# EAGLE design Comm_board_2024_L76 (EAGLE 9.6.2)
CHECKED: 02/25/2025; COMPANY: CDOSR; DATE: 02/25/2024; DESIGNER: CDOSR; DRAWN: 02/25/2024; DRGNO: 1; REV: 01; VERSION: v10; YEAR: 2024
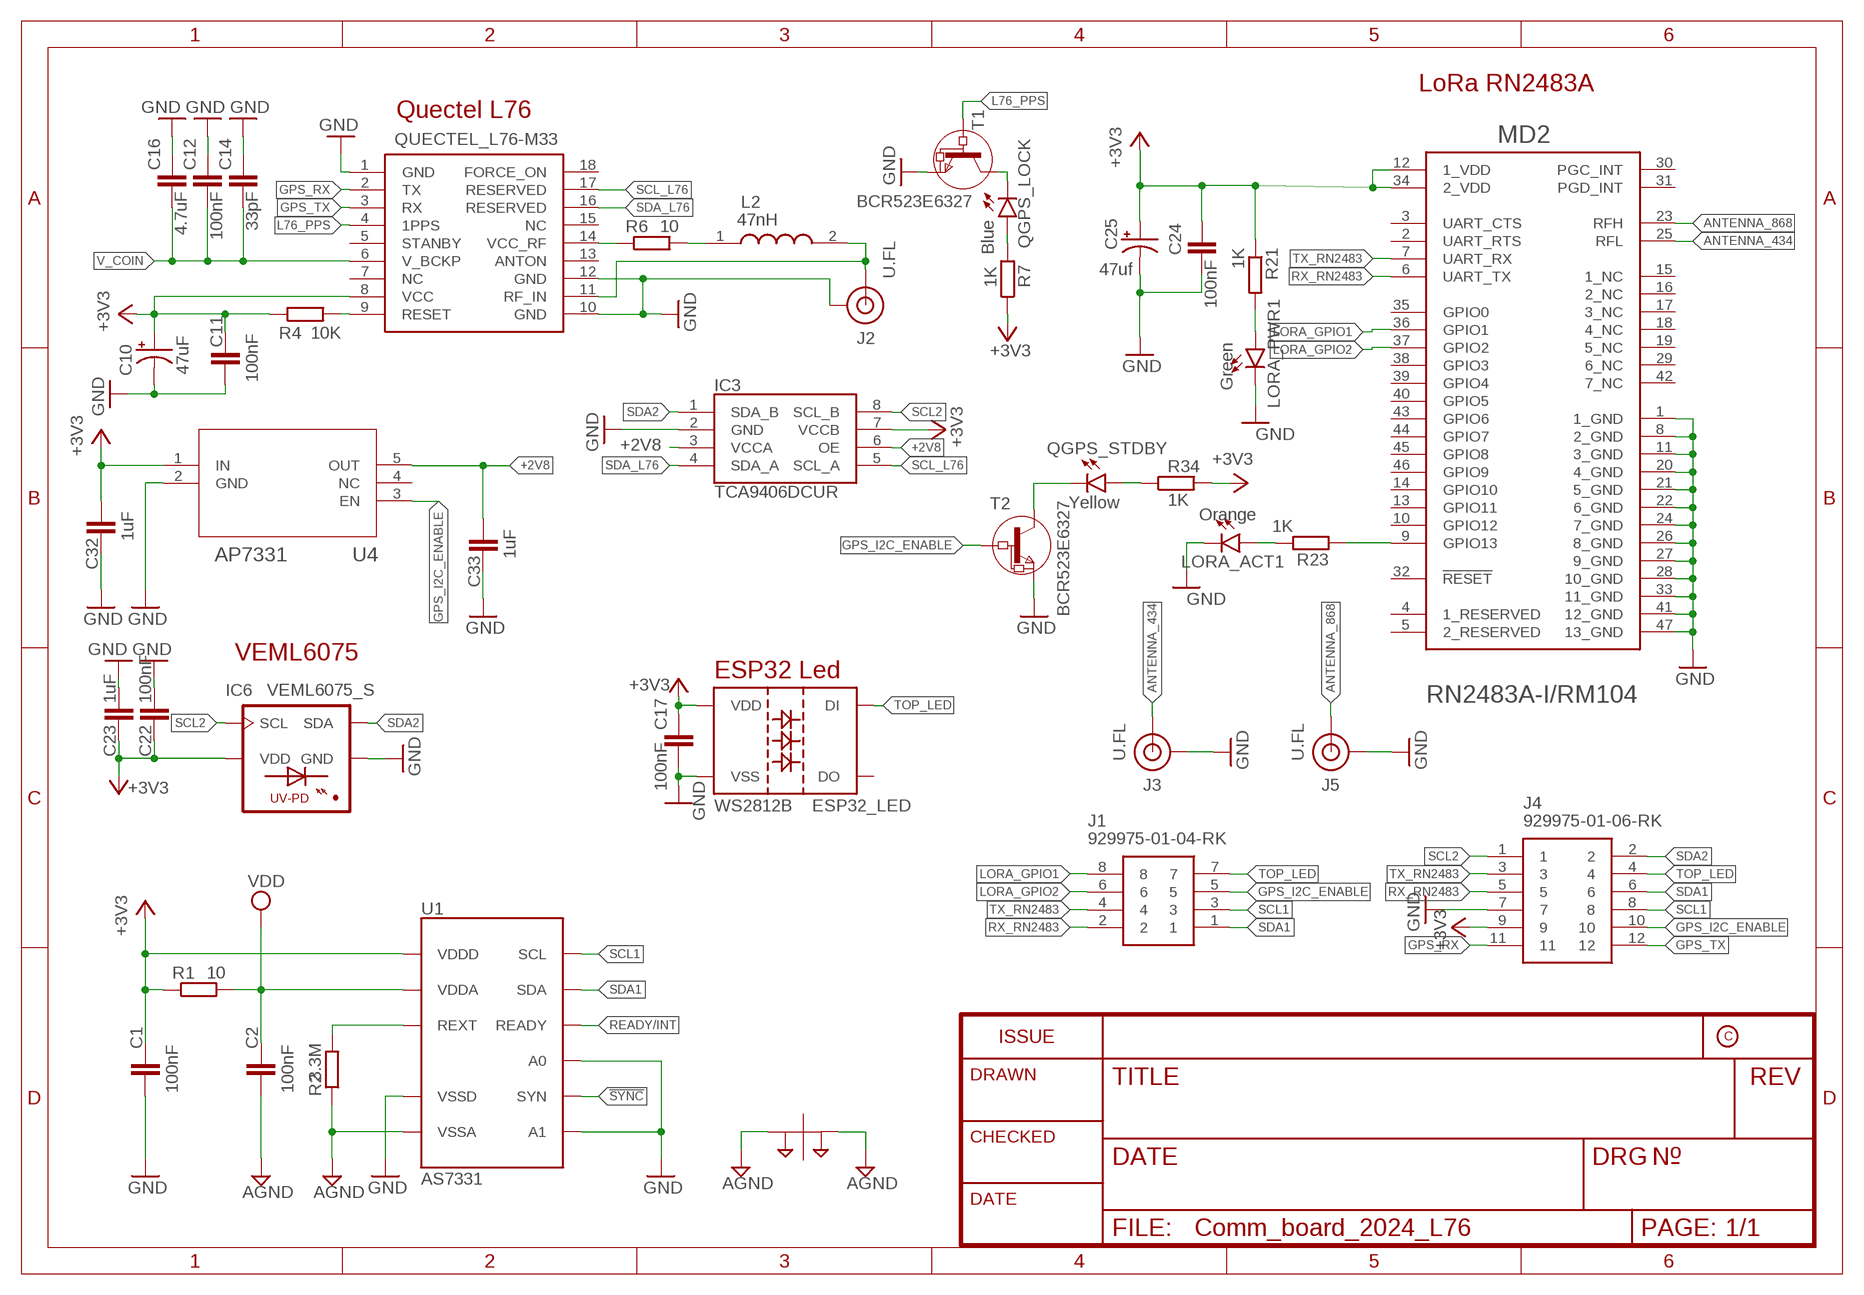
[diagram p0: schematic, sheet 1]

## Parts
C1  100nF  C-EUC0603  [C0603]
C2  100nF  C-EUC0603  [C0603]
C10  47uF  293D226X9025C2TE3  [CAPMP6032X250N]
C11  100nF  C-EUC0603  [C0603]
C12  100nF  C-EUC0603  [C0603]
C14  33pF  C-EUC0603  [C0603]
C16  4.7uF  C-EUC0603  [C0603]
C17  100nF  C-EUC0603  [C0603]
C22  100nF  C-EUC0603  [C0603]
C23  1uF  C-EUC0603  [C0603]
C24  100nF  C-EUC0603  [C0603]
C25  47uf  293D226X9025C2TE3  [CAPMP6032X250N]
C32  1uF  C-EUC0603  [C0603]
C33  1uF  C-EUC0603  [C0603]
ESP32_LED  WS2812B  [WS2812B]
IC3  TCA9406DCUR  [SOP50P310X90-8N]
IC6  VEML6075_S  [VISHAY_VEML6075_1.25X2X1]
J1  929975-01-04-RK  [RHDR8W76P254_2X4_1016X508X839P]
J2  U.FL  SPARKFUN-CONNECTORS_SPARKFUN-CONNECTORS_U.FL2PIN  [SPARKFUN-CONNECTORS_SPARKFUN-CONNECTORS_U.FL]
J3  U.FL  SPARKFUN-CONNECTORS_SPARKFUN-CONNECTORS_U.FL2PIN  [SPARKFUN-CONNECTORS_SPARKFUN-CONNECTORS_U.FL]
J4  929975-01-06-RK  [RHDR12W76P254_2X6_1524X508X839]
J5  U.FL  SPARKFUN-CONNECTORS_SPARKFUN-CONNECTORS_U.FL2PIN  [SPARKFUN-CONNECTORS_SPARKFUN-CONNECTORS_U.FL]
L2  47nH  LQW2UAS47NF00L  [LQW2UAS12NG00L]
LORA_ACT1  Orange  LEDCHIP-LED0603  [CHIP-LED0603]
LORA_PWR1  Green  LEDCHIP-LED0603  [CHIP-LED0603]
MD2  RM104_MICROCHIP_RN2483A-I-RM104MICROCHIP_RN2483A-I-RM104_0_0  [RM104_MICROCHIP_RN2483A-I-RM104_0]
QGPS_LOCK  Blue  LEDCHIP-LED0603  [CHIP-LED0603]
QGPS_STDBY  Yellow  LEDCHIP-LED0603  [CHIP-LED0603]
QUECTEL_L76-M33  L76 - M33  L76-M33  [L76-M33]
R1  10  R-EU_R0603  [R0603]
R2  3.3M  R-EU_R0603  [R0603]
R4  10K  R-EU_R0603  [R0603]
R6  10  R-EU_R0603  [R0603]
R7  1K  R-EU_R0603  [R0603]
R21  1K  R-EU_R0603  [R0603]
R23  1K  R-EU_R0603  [R0603]
R34  1K  R-EU_R0603  [R0603]
SUPPLYTIE1  SPARKFUN-POWERSYMBOLS_2PT_GND_TIE  [SPARKFUN-POWERSYMBOLS_2PT_GND_TIE]
T1  BCR523E6327  NPNSOT23  [SOT-23]
T2  BCR523E6327  NPNSOT23  [SOT-23]
U1  AS7331  SPARKFUN_QWIIC_UV_SENSOR_AS7331_UV_SENSOR_AS7331  [SPARKFUN_QWIIC_UV_SENSOR_AS7331_OLGA16]
U4  AP7331  AP7331-28WG-7SOT25_DIO  [SOT25_DIO]

## Nets
!SYNC: U1.8(SYN)
+2V8: C33.2 IC3.3(VCCA) IC3.6(OE) U4.5(OUT)
+3V3: C1.2 C10.1(+) C11.2 C17.1 C22.2 C23.1 C24.1 C25.1(+) C32.2 ESP32_LED.1(VDD) IC3.7(VCCB) IC6.4(VDD) J4.9 MD2.12(1_VDD) MD2.34(2_VDD) QUECTEL_L76-M33.8(VCC) R1.1 R4.1 R7.1 R21.1 R34.2 U1.10(VDDD) U4.1(IN)
AGND: C2.1 R2.1 SUPPLYTIE1.P$1 SUPPLYTIE1.P$2 U1.1(VSSA) U1.2(VSSA) U1.5(VSSA) U1.6(VSSA) U1.15(VSSA) U1.16(VSSA)
ANT1: J2.FEED(SIGNAL) L2.2 QUECTEL_L76-M33.11(RF_IN)
ANTENNA_434: J3.FEED(SIGNAL) MD2.25(RFL)
ANTENNA_868: J5.FEED(SIGNAL) MD2.23(RFH)
GND: C1.1 C10.2(-) C11.1 C12.2 C14.2 C16.2 C17.2 C22.1 C23.2 C24.2 C25.2(-) C32.1 C33.1 ESP32_LED.3(VSS) IC3.2(GND) IC6.1(GND) J2.1(GND) J2.2(GND) J2.3(GND) J3.1(GND) J3.2(GND) J3.3(GND) J4.7 J5.1(GND) J5.2(GND) J5.3(GND) LORA_ACT1.C LORA_PWR1.C MD2.1(1_GND) MD2.8(2_GND) MD2.11(3_GND) MD2.20(4_GND) MD2.21(5_GND) MD2.22(6_GND) MD2.24(7_GND) MD2.26(8_GND) MD2.27(9_GND) MD2.28(10_GND) MD2.33(11_GND) MD2.41(12_GND) MD2.47(13_GND) QUECTEL_L76-M33.1(GND) QUECTEL_L76-M33.10(GND) QUECTEL_L76-M33.12(GND) T1.2(E) T2.2(E) U1.7(A1) U1.11(VSSD) U1.14(A0) U4.2(GND)
GPS2_RESET: QUECTEL_L76-M33.9(RESET) R4.2
GPS_I2C_ENABLE: J1.5 J4.10 T2.3(B) U4.3(EN)
GPS_RX: J4.11 QUECTEL_L76-M33.2(TX)
GPS_TX: J4.12 QUECTEL_L76-M33.3(RX)
L76_PPS: QUECTEL_L76-M33.4(1PPS) T1.3(B)
LORA_GPIO1: J1.8 MD2.36(GPIO1)
LORA_GPIO2: J1.6 MD2.37(GPIO2)
N$1: QGPS_LOCK.C T1.1(C)
N$2: R2.2 U1.4(REXT)
N$8: QGPS_STDBY.C T2.1(C)
N$10: L2.1 R6.2
N$20: QGPS_STDBY.A R34.1
N$24: QUECTEL_L76-M33.14(VCC_RF) R6.1
N$37: QGPS_LOCK.A R7.2
N$41: MD2.9(GPIO13) R23.1
N$42: LORA_ACT1.A R23.2
N$43: LORA_PWR1.A R21.2
READY/INT: U1.9(READY)
RX_RN2483: J1.2 J4.5 MD2.6(UART_TX)
SCL1: J1.3 J4.8 U1.13(SCL)
SCL2: IC3.8(SCL_B) IC6.3(SCL) J4.1
SCL_L76: IC3.5(SCL_A) QUECTEL_L76-M33.17(RESERVED)
SDA1: J1.1 J4.6 U1.12(SDA)
SDA2: IC3.1(SDA_B) IC6.2(SDA) J4.2
SDA_L76: IC3.4(SDA_A) QUECTEL_L76-M33.16(RESERVED)
TOP_LED: ESP32_LED.4(DI) J1.7 J4.4
TX_RN2483: J1.4 J4.3 MD2.7(UART_RX)
V_COIN: C12.1 C14.1 C16.1 QUECTEL_L76-M33.6(V_BCKP)
VDD: C2.2 R1.2 U1.3(VDDA)
Unconnected: ESP32_LED.2(DO) MD2.2(UART_RTS) MD2.3(UART_CTS) MD2.4(1_RESERVED) MD2.5(2_RESERVED) MD2.10(GPIO12) MD2.13(GPIO11) MD2.14(GPIO10) MD2.15(1_NC) MD2.16(2_NC) MD2.17(3_NC) MD2.18(4_NC) MD2.19(5_NC) MD2.29(6_NC) MD2.30(PGC_INT) MD2.31(PGD_INT) MD2.32(!RESET!) MD2.35(GPIO0) MD2.38(GPIO3) MD2.39(GPIO4) MD2.40(GPIO5) MD2.42(7_NC) MD2.43(GPIO6) MD2.44(GPIO7) MD2.45(GPIO8) MD2.46(GPIO9) QUECTEL_L76-M33.5(STANBY) QUECTEL_L76-M33.7(NC) QUECTEL_L76-M33.13(ANTON) QUECTEL_L76-M33.15(NC) QUECTEL_L76-M33.18(FORCE_ON) U4.4(NC)

## Notes on the sheet
- LoRa RN2483A
- Quectel L76
- VEML6075
- ESP32 Led

## Library data of the parts
C1 C2 C11 C12 C14 C16 C17 C22-C24 C32 C33 = rcl:C-EU: CAPACITOR, European symbol; SPICEPREFIX: C
C10 C25 = 293D226X9025C2TE3:293D226X9025C2TE3: Surface Mount Tantalum Capacitor, TANTAMOUNTr, 293D Series, 22 F, 10%, 25 V, 2412 Check prices <https://pricing.snapeda.com/parts/293D226X9025C2TE3/Vishay/view-part?ref=eda>; AVAILABILITY: Warning; DESCRIPTION: Surface Mount Tantalum Capacitor, TANTAMOUNTr, 293D Series, 22 F, 10%, 25 V, 2412 [6032 Metric]; MF: Vishay; MP: 293D226X9025C2TE3; PACKAGE: None; PRICE: None; PURCHASE-URL: https://pricing.snapeda.com/search/part/293D226X9025C2TE3/?ref=eda
ESP32_LED = WS2812:WS2812B
IC3 = TCA9406DCUR:TCA9406DCUR: 2-Bit Bidirectional 1-MHz I2C Bus and SMBus Voltage-Level Shifter Source: Datasheet <http://www.ti.com/lit/ds/symlink/tca9406.pdf>; DESCRIPTION: 2-Bit Bidirectional 1-MHz I2C Bus and SMBus Voltage-Level Shifter; HEIGHT: 0.9mm; MANUFACTURER_NAME: Texas Instruments; MANUFACTURER_PART_NUMBER: TCA9406DCUR; MOUSER_PART_NUMBER: 595-TCA9406DCUR; MOUSER_PRICE-STOCK: https://www.mouser.co.uk/ProductDetail/Texas-Instruments/TCA9406DCUR?qs=Ze4%2FuFuz19JoG7CJtrwdKQ%3D%3D
IC6 = VEML6075:VEML6075_S: VEML6075 UVA and UVB Light Sensor with I2C Interface: The VEML6075 senses UVA and UVB light and incorporates photodiode, amplifiers, and analog / digital circuits into a single chip using a CMOS process. When the UV sensor is applied, it is able to detect UVA and UVB intensity to provide a measure of the signal strength as well as allowing for UVI measurement. Device Model created 15.06.2016 by Johannes Kolb - Vishay Semiconductor GmbH; DESCRIPTION: Optical Sensor Ultraviolet _UV_ 330nm, 365nm I²C 4-TFLGA; DIGI-KEY_PART_NUMBER: VEML6075CT-ND; DIGI-KEY_PURCHASE_URL: https://www.digikey.com/product-detail/en/vishay-semiconductor-opto-division/VEML6075/VEML6075CT-ND/5878946?utm_source=snapeda&utm_medium=aggregator&utm_campaign=symbol; MF: Vishay Semiconductor; MP: VEML6075; PACKAGE: TFLGA-4 Vishay
J1 = 929975-01-04-RK:929975-01-04-RK: 8 Position Receptacle Connector 0.100" (2.54mm) Through Hole Tin Source: Datasheet <https://componentsearchengine.com/Datasheets/1/929975-01-04-RK.pdf>; DESCRIPTION: 8 Position Receptacle Connector 0.100" (2.54mm) Through Hole Tin; HEIGHT: 8.387mm; MANUFACTURER_NAME: 3M; MANUFACTURER_PART_NUMBER: 929975-01-04-RK; MOUSER_PART_NUMBER: 517-929975-01-04-RK; MOUSER_PRICE-STOCK: https://www.mouser.com/Search/Refine.aspx?Keyword=517-929975-01-04-RK
J2 J3 J5 = U-FL_Connector:SPARKFUN-CONNECTORS_SPARKFUN-CONNECTORS_U.FL2PIN: SMD Antenna Connector - U.FL 2mm height, 3.0mm x 3.0mm receptacle size. SparkFun Products: SparkFun WiFi Shield - ESP8266 <https://www.sparkfun.com/products/13287> SparkFun ESP8266 Thing <https://www.sparkfun.com/products/13231> SparkFun MiniGen - Pro Mini Signal Generator Shield <https://www.sparkfun.com/products/11420>; PROD_ID: CONN-09193; SF_ID: WRL-09144
J4 = 929975-01-06-RK:929975-01-06-RK: Headers & Wire Housings 2ROW BDMNT SCKT SN STRT SLDR TAIL Source: Datasheet <https://multimedia.3m.com/mws/media/22500O/3mtm-boardmount-skt-100-100x-100strt-sldr-tails-ts0815.pdf>; DESCRIPTION: Headers & Wire Housings 2ROW BDMNT SCKT SN STRT SLDR TAIL; HEIGHT: 8.387mm; MANUFACTURER_NAME: 3M; MANUFACTURER_PART_NUMBER: 929975-01-06-RK; MOUSER_PART_NUMBER: 517-929975-01-06-RK; MOUSER_PRICE-STOCK: https://www.mouser.co.uk/ProductDetail/3M-Electronic-Solutions-Division/929975-01-06-RK?qs=4V84emjyG36joYvi6g1rwA%3D%3D
L2 = LQW2UAS47NF00L:LQW2UAS47NF00L: LQW2UAS_00 Series Inductor 47nH +/-1% 1008 (2520) Source: Datasheet <https://psearch.en.murata.com/inductor/product/LQW2UAS47NF00#.html>; DESCRIPTION: LQW2UAS_00 Series Inductor 47nH +/-1% 1008 (2520); HEIGHT: 2.03mm; MANUFACTURER_NAME: Murata Electronics; MANUFACTURER_PART_NUMBER: LQW2UAS47NF00L; MOUSER_PART_NUMBER: 81-LQW2UAS47NF00L; MOUSER_PRICE-STOCK: https://www.mouser.co.uk/ProductDetail/Murata-Electronics/LQW2UAS47NF00L?qs=Mv7BduZupUinLFmDX5aZtw%3D%3D
LORA_ACT1 LORA_PWR1 QGPS_LOCK QGPS_STDBY = led:LED: LED OSRAM: - CHIPLED LG R971, LG N971, LY N971, LG Q971, LY Q971, LO R971, LY R971 LH N974, LH R974 LS Q976, LO Q976, LY Q976 LO Q996 - Hyper CHIPLED LW Q18S LB Q993, LB Q99A, LB R99A - SideLED LS A670, LO A670, LY A670, LG A670, LP A670 LB A673, LV A673, LT A673, LW A673 LH A674 LY A675 LS A676, LA A676, LO A676, LY A676, LW A676 LS A679, LY A679, LG A679 - Hyper Micro SIDELED® LS Y876, LA Y876, LO Y876, LY Y876 LT Y87S - SmartLED LW L88C, LW L88S LB L89C, LB L89S, LG L890 LS L89K, LO L89K, LY L89K LS L896, LA L896, LO L896, LY L896 - TOPLED LS T670, LO T670, LY T670, LG T670, LP T670 LSG T670, LSP T670, LSY T670, LOP T670, LYG T670 LG T671, LOG T671, LSG T671 LB T673, LV T673, LT T673, LW T673 LH T674 LS T676, LA T676, LO T676, LY T676, LB T676, LH T676, LSB T676, LW T676 LB T67C, LV T67C, LT T67C, LS T67K, LO T67K, LY T67K, LW E67C LS E67B, LA E67B, LO E67B, LY E67B, LB E67C, LV E67C, LT E67C LW T67C LS T679, LY T679, LG T679 LS T770, LO T770, LY T770, LG T770, LP T770 LB T773, LV T773, LT T773, LW T773 LH T774 LS E675, LA E675, LY E675, LS T675 LS T776, LA T776, LO T776, LY T776, LB T776 LHGB T686 LT T68C, LB T68C - Hyper Mini TOPLED® LB M676 - Mini TOPLED Santana® LG M470 LS M47K, LO M47K, LY M47K Source: http://www.osram.convergy.de LUXEON: - LUMILED® LXK2-PW12-R00, LXK2-PW12-S00, LXK2-PW14-U00, LXK2-PW14-V00 LXK2-PM12-R00, LXK2-PM12-S00, LXK2-PM14-U00 LXK2-PE12-Q00, LXK2-PE12-R00, LXK2-PE12-S00, LXK2-PE14-T00, LXK2-PE14-U00 LXK2-PB12-K00, LXK2-PB12-L00, LXK2-PB12-M00, LXK2-PB14-N00, LXK2-PB14-P00, LXK2-PB14-Q00 LXK2-PR12-L00, LXK2-PR12-M00, LXK2-PR14-Q00, LXK2-PR14-R00 LXK2-PD12-Q00, LXK2-PD12-R00, LXK2-PD12-S00 LXK2-PH12-R00, LXK2-PH12-S00 LXK2-PL12-P00, LXK2-PL12-Q00, LXK2-PL12-R00 Source: www.luxeon.com KINGBRIGHT: KA-3528ASYC Source: www.kingbright.com
MD2 = main pcb:RM104_MICROCHIP_RN2483A-I-RM104: RN2483A-I/RM104; AUTOMOTIVE: No; BANDWIDTH: 1.74MHz; CENTROID_NOT_SPECIFIED: No; DATASHEET: http://ww1.microchip.com/downloads/en/DeviceDoc/RN2483-Low-Power-Long-Range-LoRa-Technology-Transceiver-Module-Data-Sheet-DS50002346D.pdf; DATA_RATE: 300kbits/s; DEVICE_CLASS_L1: Integrated Circuits (ICs); DEVICE_CLASS_L2: RF Semiconductors and Devices; DEVICE_CLASS_L3: Transceivers; DIGIKEY_DESCRIPTION: UNK RN2483A-I/RM104; DIGIKEY_PART_NUMBER: RN2483A-I/RM104-ND; FOOTPRINT_VARIANT_NAME_0: Recommended_Land_Pattern; HEIGHT: 3.467mm; INTERFACE: I2C,SPI,UART; LEAD_FREE: Yes; MAX_FREQUENCY: 870MHz; MAX_SUPPLY_VOLTAGE: 3.6V; MF: Microchip; MFG_PACKAGE_IDENT: RN2483A-I/RM104; MFG_PACKAGE_IDENT_DATE: 0; MFG_PACKAGE_IDENT_REV: 0; MIN_SUPPLY_VOLTAGE: 2.1V; MOUSER_DESCRIPTION: RF Transceiver Module FSK/GFSK/LoRa 434.79MHz/870MHz 3.3V SMD Tray; MOUSER_PART_NUMBER: 579-RN2483A-I/RM104; MPN: RN2483A-I/RM104; NUMBER_OF_ADC_CHANNELS: 13; NUMBER_OF_GPIO: 14; PACKAGE: TRX_MD_26MM67_17MM78; PREFIX: MD; ROHS: Yes; SENSITIVITY: -146dBm; TEMPERATURE_RANGE_HIGH: +85°C; TEMPERATURE_RANGE_LOW: -40°C; TRANSMITTING_CURRENT: 44.5mA; VERIFICATION_VERSION: 0.0.0.3
QUECTEL_L76-M33 = gps:L76-M33
R1 R2 R4 R6 R7 R21 R23 R34 = rcl:R-EU_: RESISTOR, European symbol; SPICEPREFIX: R
SUPPLYTIE1 = SparkFun_Qwiic_Mini_UV_Sensor_AS7331_power:SPARKFUN-POWERSYMBOLS_2PT_GND_TIE: Dual Ground Supply Power supply symbol for connecting two grounds. SparkFun Products: SparkFun AutoDriver - Stepper Motor Driver <https://www.sparkfun.com/products/11611>
T1 = zetex:NPNSOT23: NPN TRANSISTOR; MPN: DSS20201L-7; OC_FARNELL: 1710688; OC_NEWARK: 25R4555
T2 = zetex:NPNSOT23: NPN TRANSISTOR; MPN: DSS20201L-7; OC_FARNELL: 1710688; OC_NEWARK: 25R4555; SPICEPREFIX: J
U1 = SparkFun_Qwiic_Mini_UV_Sensor_AS7331:SPARKFUN_QWIIC_UV_SENSOR_AS7331_UV_SENSOR_AS7331; PROD_ID: IC-20090
U4 = AP7331-28WG:AP7331-28WG-7; COPYRIGHT: Copyright (C) 2022 Ultra Librarian. All rights reserved.; MANUFACTURER_PART_NUMBER: AP7331-28WG-7; MFR_NAME: Diodes Inc

## Net classes
0 Default: width 0.203 mm
1 highpower: width 0.305 mm, drill 0.483 mm
2 lowpower: width 0.254 mm, drill 0.483 mm

## Board
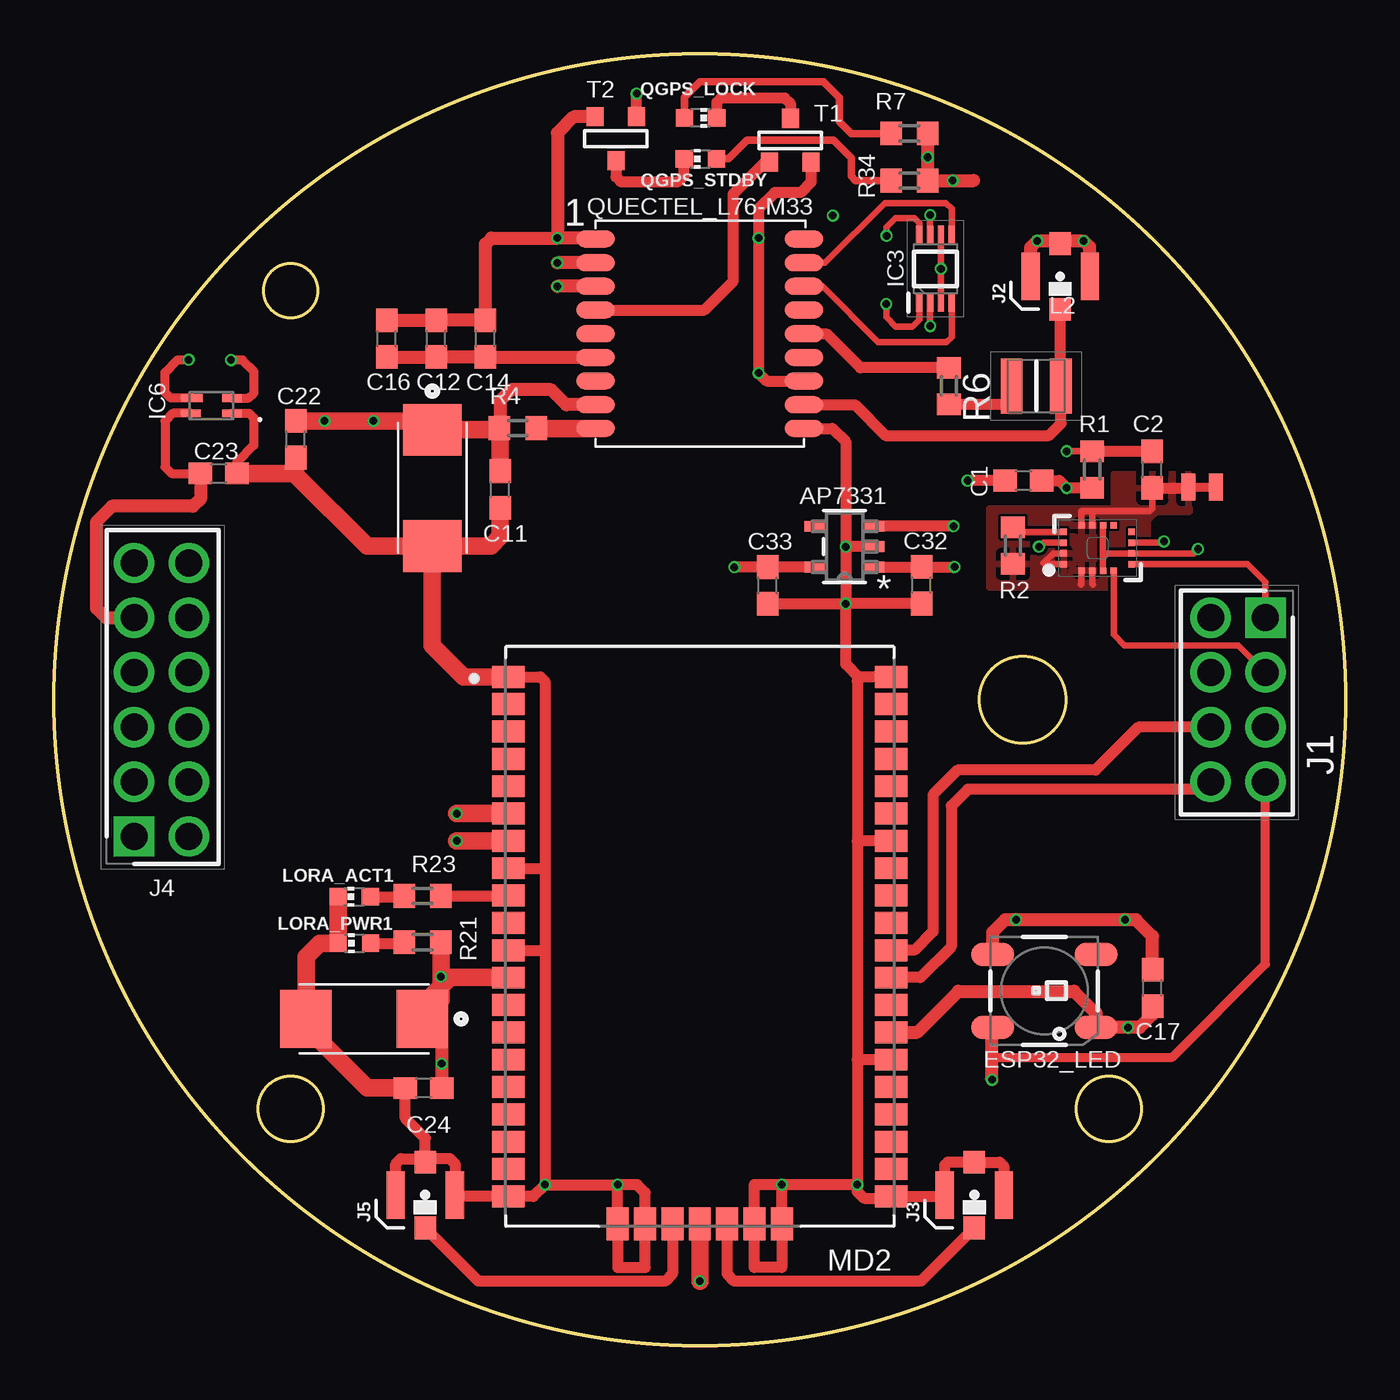
[diagram p1: board, top side]
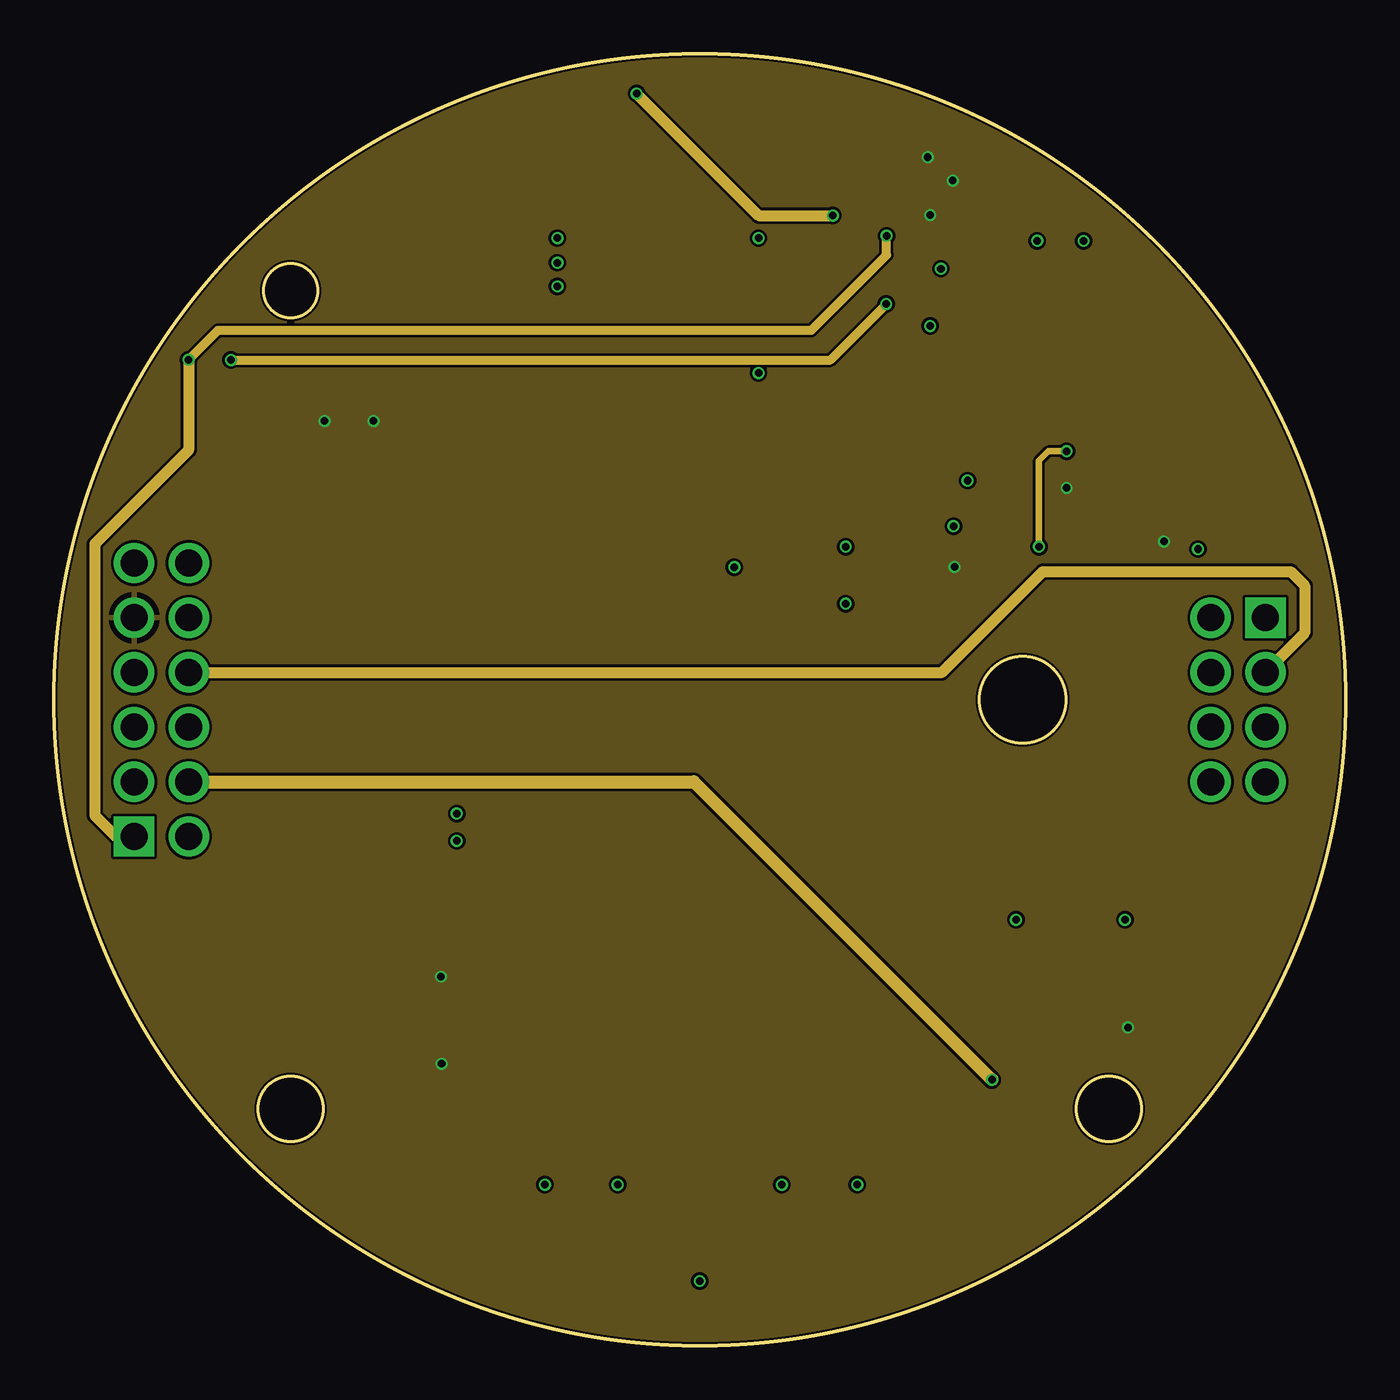
[diagram p2: board, inner layer Route2]
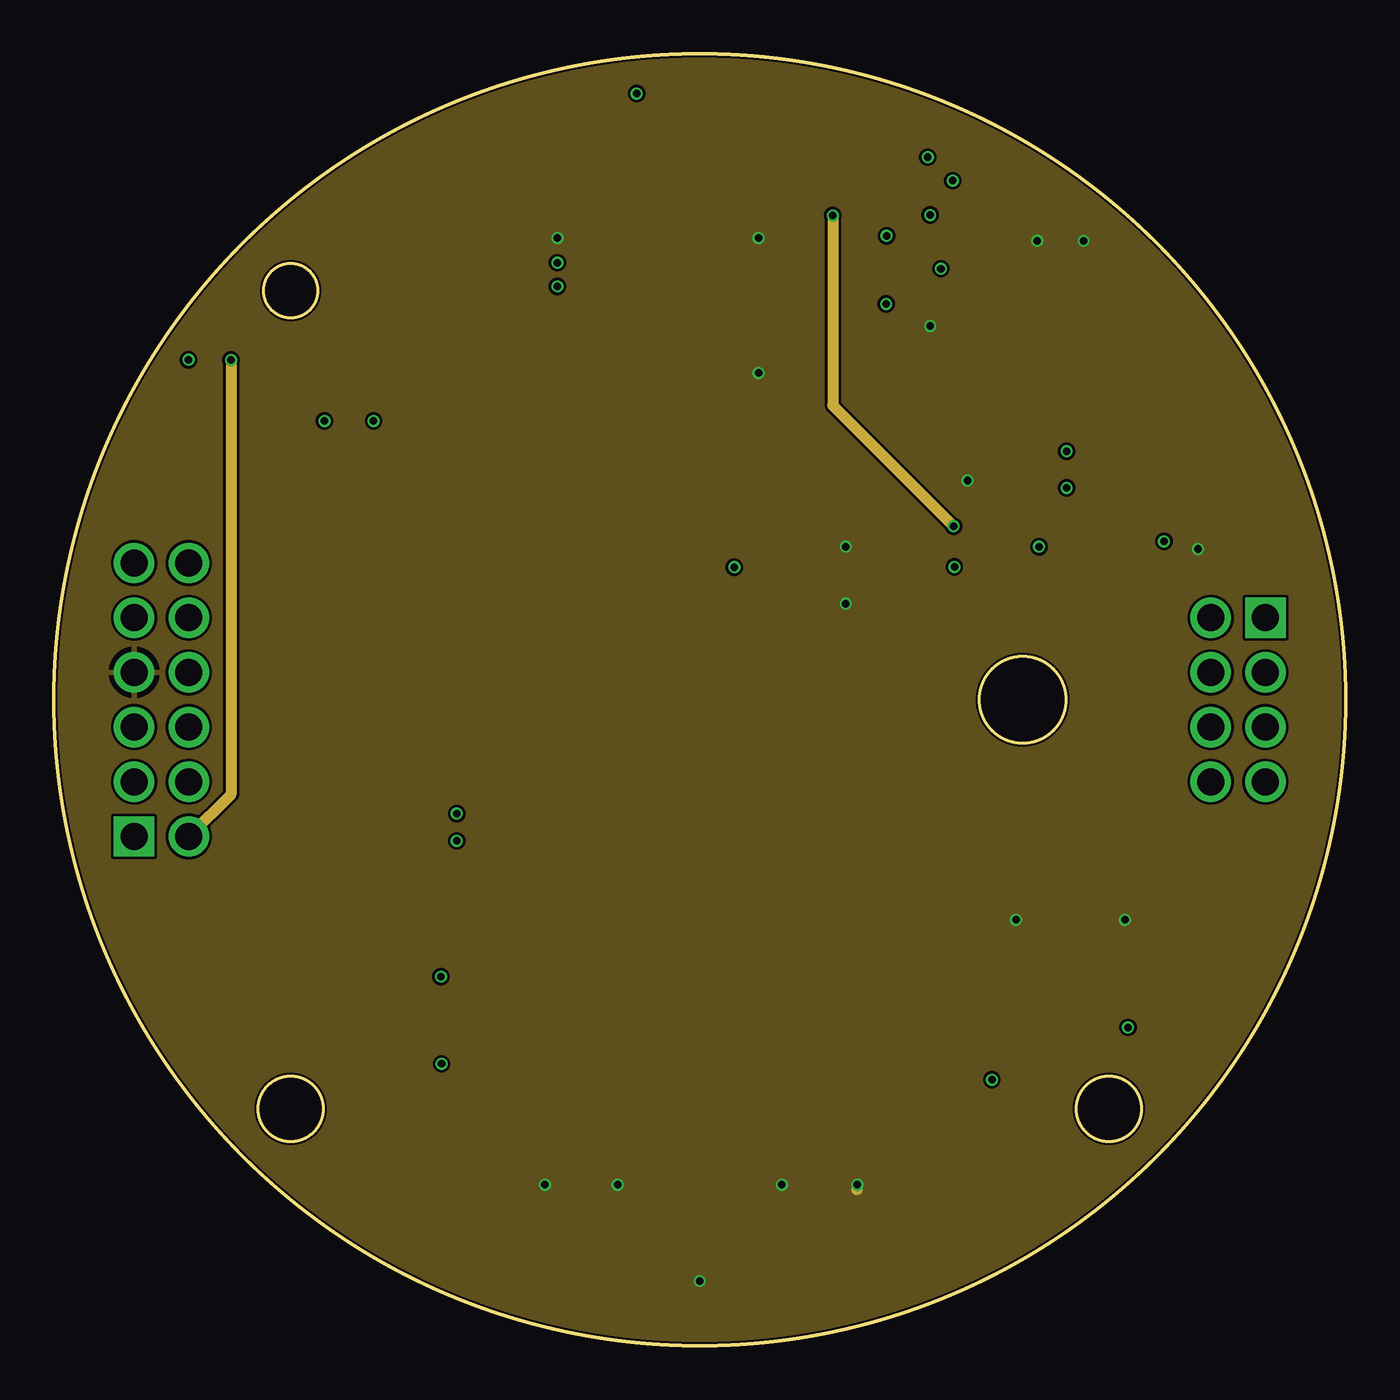
[diagram p3: board, inner layer Route15]
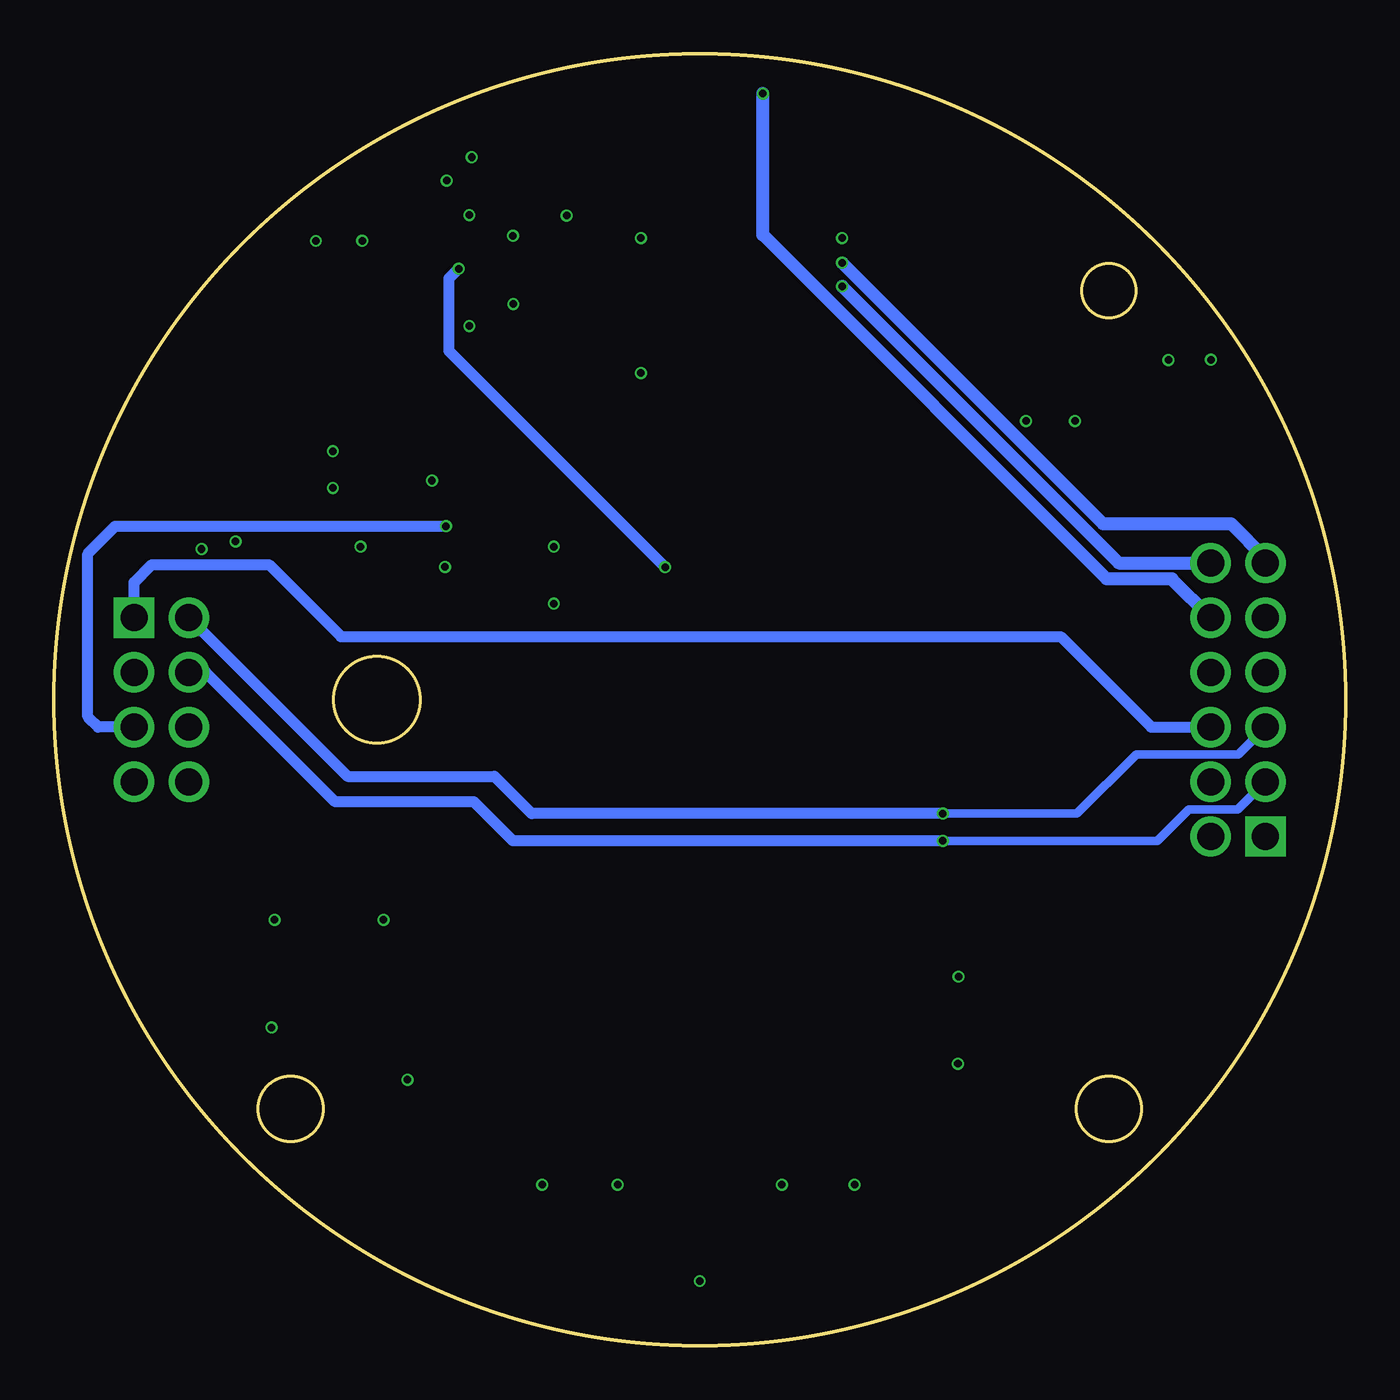
[diagram p4: board, bottom side, seen from below]

Size 60 x 60 mm. Coordinates in mm from the lower left corner, seen from the top.
Outline: circle at 30,30 radius 30
Outline: circle at 11,49 radius 1.25
Outline: circle at 11,11 radius 1.5
Outline: circle at 49,11 radius 1.5
Outline: circle at 45,30 radius 2
Copper layers (1*2*15*16): Top 0.035559375mm / dielectric 0.17018125mm / Route2 0.01778125mm / dielectric 47mil / Route15 0.01778125mm / dielectric 0.17018125mm / Bottom 0.035559375mm
Design rules "jlcpcb-4-layer": minimum track width 5mil, minimum drill 0.2mm, track to track 0.126490625mm, track to pad 0.126490625mm, pad to pad 0.126490625mm, via to via 0.126490625mm, smd to smd 0mil, copper to edge 0.1mm, drill to drill 5mil, minimum pad ring 4mil, minimum via ring 4mil, stop-mask expansion 3mil, vias tented up to drill 100mil, thermal gap 10mil

### Footprints (pad centres in the part's own frame; a part is rotated, then mirrored left to right if it is on the bottom)
C0603 = smd 1.1 x 1: 1 -0.85,0; 2 0.85,0
CAPMP6032X250N = smd 2.4 x 2.7: 1 -2.7,0; 2 2.7,0
WS2812B = smd 2 x 1.1: 1 -2.4,1.7; 2 -2.4,-1.7; 3 2.4,-1.7; 4 2.4,1.7
SOP50P310X90-8N = smd 0.85 x 0.3: 1 -1.575,0.75; 2 -1.575,0.25; 3 -1.575,-0.25; 4 -1.575,-0.75; 5 1.575,-0.75; 6 1.575,-0.25; 7 1.575,0.25; 8 1.575,0.75
VISHAY_VEML6075_1.25X2X1 = smd 0.9 x 0.35: 1 -0.95,0.35; 2 -0.95,-0.35; 4 0.95,0.35 | smd 1 x 0.35: 3 0.9,-0.35
RHDR8W76P254_2X4_1016X508X839P = drill 1.25 pad 1.875 square: 1 3.81,-1.27 | drill 1.25 pad 1.875: 2 3.81,1.27; 3 1.27,-1.27; 4 1.27,1.27; 5 -1.27,-1.27; 6 -1.27,1.27; 7 -3.81,-1.27; 8 -3.81,1.27
SPARKFUN-CONNECTORS_SPARKFUN-CONNECTORS_U.FL = smd 2.2 x 0.85: 1 0,1.375; 2 0,-1.375 | smd 1.05 x 1: 3 1.525,0; FEED -1.525,0
RHDR12W76P254_2X6_1524X508X839 = drill 1.25 pad 1.875 square: 1 6.35,-1.27 | drill 1.25 pad 1.875: 2 6.35,1.27; 3 3.81,-1.27; 4 3.81,1.27; 5 1.27,-1.27; 6 1.27,1.27; 7 -1.27,-1.27; 8 -1.27,1.27; 9 -3.81,-1.27; 10 -3.81,1.27; 11 -6.35,-1.27; 12 -6.35,1.27
LQW2UAS12NG00L = smd 1.015 x 2.54: 1 -1.143,0; 2 1.143,0
CHIP-LED0603 = smd 0.8 x 0.8: A 0,-0.75; C 0,0.75
RM104_MICROCHIP_RN2483A-I-RM104_0 = smd 1.524 x 1.016: 1 8.89,-12.065; 2 8.89,-10.795; 3 8.89,-9.525; 4 8.89,-8.255; 5 8.89,-6.985; 6 8.89,-5.715; 7 8.89,-4.445; 8 8.89,-3.175; 9 8.89,-1.905; 10 8.89,-0.635; 11 8.89,0.635; 12 8.89,1.905; 13 8.89,3.175; 14 8.89,4.445; 15 8.89,5.715; 16 8.89,6.985; 17 8.89,8.255; 18 8.89,9.525; 19 8.89,10.795; 20 8.89,12.065; 28 -8.89,12.065; 29 -8.89,10.795; 30 -8.89,9.525; 31 -8.89,8.255; 32 -8.89,6.985; 33 -8.89,5.715; 34 -8.89,4.445; 35 -8.89,3.175; 36 -8.89,1.905; 37 -8.89,0.635; 38 -8.89,-0.635; 39 -8.89,-1.905; 40 -8.89,-3.175; 41 -8.89,-4.445; 42 -8.89,-5.715; 43 -8.89,-6.985; 44 -8.89,-8.255; 45 -8.89,-9.525; 46 -8.89,-10.795; 47 -8.89,-12.065 | smd 1.016 x 1.524: 21 3.81,13.335; 22 2.54,13.335; 23 1.27,13.335; 24 0,13.335; 25 -1.27,13.335; 26 -2.54,13.335; 27 -3.81,13.335
L76-M33 = smd 1.8 x 0.8: 1 -4.85,4.4; 2 -4.85,3.3; 3 -4.85,2.2; 4 -4.85,1.1; 5 -4.85,0; 6 -4.85,-1.1; 7 -4.85,-2.2; 8 -4.85,-3.3; 9 -4.85,-4.4; 10 4.85,-4.4; 11 4.85,-3.3; 12 4.85,-2.2; 13 4.85,-1.1; 14 4.85,0; 15 4.85,1.1; 16 4.85,2.2; 17 4.85,3.3; 18 4.85,4.4
R0603 = smd 1 x 1.1: 1 -0.85,0; 2 0.85,0
SPARKFUN-POWERSYMBOLS_2PT_GND_TIE = smd 1.27 x 0.635: P$1 0,0.635; P$2 0,-0.635
SOT-23 = smd 0.787 x 0.889: 1 0.025,-1.016; 2 -0.94,1.016; 3 0.991,1.016
SPARKFUN_QWIIC_UV_SENSOR_AS7331_OLGA16 = smd 0.3 x 0.3: 1 -0.75,1.575; 2 -0.25,1.575; 3 0.25,1.575; 4 0.75,1.575; 5 1.05,0.75; 6 1.05,0.25; 7 1.05,-0.25; 8 1.05,-0.75; 9 0.75,-1.575; 10 0.25,-1.575; 11 -0.25,-1.575; 12 -0.75,-1.575; 13 -1.05,-0.75; 14 -1.05,-0.25; 15 -1.05,0.25; 16 -1.05,0.75
SOT25_DIO = smd 1.006 x 0.5: 1 -1.353,0.95; 2 -1.353,0; 3 -1.353,-0.95; 4 1.353,-0.95; 5 1.353,0.95

### Placement (x,y rotation side)
C1  45.03,40.18 0 top
C2  51.01,40.69 90 top
C10  17.58,39.84 270 top
C11  20.73,39.77 90 top
C12  17.76,46.77 90 top
C14  20.05,46.77 90 top
C16  15.46,46.77 90 top
C17  51.03,16.62 90 top
C22  11.24,42.1 90 top
C23  7.66,40.51 0 top
C24  17.17,11.97 180 top
C25  14.41,15.18 180 top
C32  40.3,35.32 90 top
C33  33.15,35.31 90 top
ESP32_LED  46,16.48 180 top
IC3  40.95,50.02 90 top
IC6  7.32,43.66 180 top
J1  55,30 90 top
J2  46.74,49.66 90 top
J3  42.75,7 90 top
J4  5,30 270 top
J5  17.25,7 90 top
L2  45.63,44.57 0 top
LORA_ACT1  13.95,20.85 90 top
LORA_PWR1  13.96,18.69 90 top
MD2  30,19 180 top
QGPS_LOCK  30.04,57.02 270 top
QGPS_STDBY  30.03,55.12 90 top
QUECTEL_L76-M33  30,47 0 top
R1  48.22,40.69 90 top
R2  44.54,37.16 90 top
R4  21.55,42.62 0 top
R6  41.57,44.57 270 top
R7  39.74,56.3 180 top
R21  17.13,18.74 180 top
R23  17.13,20.89 180 top
R34  39.74,54.11 0 top
SUPPLYTIE1  53.33,39.88 90 top
T1  34.23,55.98 180 top
T2  26.08,56.06 0 top
U1  48.48,37.05 90 top
U4  36.73,37.11 180 top

### Tracks (layer width: path | path; a pad name or v marks a point on that pad's centre or on a via)
+2V8  (via drill 0.35)
  Top 0.305: IC3.3 v41.2,50.02 IC3.6
  Top 0.508: U4.5 C33.2 v31.61,36.16
  Bottom 0.508: v31.61,36.16 41.66,46.21 41.66,49.56 v41.2,50.02
+3V3  (via drill 0.35)
  Top 0.3: U1.10 51.56,37.3 v51.56,37.35
  Top 0.305: v40.7,52.52 IC3.7
  Top 0.406: IC6.4 5.53,43.31 5.17,42.95 5.17,40.81 5.47,40.51 C23.1
  Top 0.508: U4.1 C32.2 v41.83,36.17 | 18.39,17.09 18.02,17.09 v17.98,17.14 | C1.2 46.7,40.18 v47.04,39.84 R1.1
  Top 0.61: C17.1 51.03,15.38 50.43,14.78 v49.89,14.78 ESP32_LED.1 48.4,15.44 47.38,16.46 42.01,16.46 40.11,14.55 MD2.34 | C24.1 v18.01,13.09 18.01,15.12 17.53,15.6 | QUECTEL_L76-M33.8 23.8,43.7 23.1,44.4 21.24,44.4 20.73,43.89 20.73,42.43 | 42.73,54.11 v41.75,54.11 R34.2 v40.59,55.2 40.59,56.22 40.63,56.26 R7.1 | C23.1 6.81,39.34 6.46,38.99 2.71,38.99 1.97,38.25 1.97,34.25 2.41,33.81 J4.9
  Top 0.813: R21.1 v17.98,17.14 17.98,16.05 17.53,15.6 C25.1 17.11,15.81 18.39,17.09 MD2.12 | R4.1 20.62,42.54 | 20.62,42.54 C10.1 17.17,42.95 v14.85,42.95 v12.57,42.95 C22.2 | C11.2 20.73,42.43 20.62,42.54
  pour Route2: -5,65 65,65 65,-5 -5,-5
AGND
  Top 0.3: SUPPLYTIE1.P$1 SUPPLYTIE1.P$2 | U1.6 48.23,38.7 48.29,38.76 | C2.1 51.03,39.82 51.03,38.89 50.9,38.76 48.29,38.76 | U1.5 47.73,38.76 48.29,38.76 | U1.1 46.02,36.3 45.97,36.35 46.42,36.8 U1.2 | U1.16 47.73,35.37 47.7,35.34 | U1.15 48.23,35.38 48.25,35.36
  Top 0.508: C2.1 52.66,39.84 SUPPLYTIE1.P$1
  pour Top: 43.45,35.22 50.8,35.22 50.8,38.33 51.2,38.73 52.74,38.73 52.74,40.47 49.24,40.47 49.24,38.89 43.45,38.89
ANT1
  Top 0.508: J2.FEED 46.74,43.71 L2.2 46.77,42.83 46.22,42.28 38.62,42.28 37.2,43.7 QUECTEL_L76-M33.11
ANTENNA_434
  Top 0.508: MD2.25 31.27,3.33 31.6,3 40.27,3 J3.FEED
ANTENNA_868
  Top 0.508: MD2.23 28.73,3.33 28.4,3 19.73,3 J5.FEED
GND  (via drill 0.35)
  Top 0.3: U1.7 48.73,36.8 | 48.73,36.8 U1.14 | v53.14,37 52.94,36.8 U1.11 48.73,36.8
  Top 0.305: IC3.2 v40.7,47.36
  Top 0.406: IC6.1 9.07,43.31 9.29,43.09 9.29,41.82 8.51,41.04 C23.2
  Top 0.508: C33.1 v36.78,34.46 | v36.78,34.46 C32.1 | U4.2 v36.78,37.11 | v36.78,37.11 v36.78,34.46 | MD2.47 37.52,31.07 37.44,30.99 | 37.44,30.99 37.32,30.87 37.32,23.44 | 37.32,23.44 37.32,13.29 | 37.32,13.29 v37.32,7.48 | v37.32,7.48 37.32,7.15 37.62,6.85 38.8,6.85 MD2.28 41.31,6.93 J3.1 41.38,8.39 41.52,8.52 J3.3 43.94,8.52 44.12,8.34 J3.2 | MD2.33 37.33,13.29 37.32,13.29 | MD2.41 37.33,23.45 37.32,23.44 | v37.32,7.48 v33.81,7.48 | v33.81,7.48 32.54,7.48 MD2.26 32.54,3.64 33.81,3.64 MD2.27 v33.81,7.48 | 37.44,30.99 36.78,31.65 v36.78,34.46 | MD2.1 22.59,31.07 22.81,30.85 22.81,22.16 | 22.81,22.16 22.81,18.35 | 22.81,18.35 v22.81,7.48 | v22.81,7.48 22.27,6.93 MD2.20 18.69,6.93 J5.2 18.62,8.45 18.4,8.68 17.41,8.68 J5.3 | J5.1 15.88,8.45 16.11,8.68 17.09,8.68 J5.3 | J5.3 17.25,9.63 16.32,10.56 C24.2 | v26.19,7.48 27.09,7.48 27.46,7.11 MD2.22 27.46,3.63 26.19,3.63 MD2.21 v26.19,7.48 | v22.81,7.48 v26.19,7.48 | MD2.11 22.8,18.37 22.81,18.35 | MD2.8 22.8,22.18 22.81,22.16 | QUECTEL_L76-M33.10 36.16,42.6 36.78,41.98 v36.78,37.11 | T1.2 35.17,54.04 34.69,53.56 33.49,53.56 32.73,52.8 v32.73,51.44 v32.73,45.18 | QUECTEL_L76-M33.12 33.11,44.8 v32.73,45.18 | v32.73,45.18 v32.73,45.17 | C1.1 v42.44,40.18
  Top 0.61: C17.2 51.03,19.01 50.26,19.78 v49.75,19.78 v44.69,19.78 44.18,19.78 43.6,19.2 ESP32_LED.3 | C16.2 C12.2 C14.2 20.05,51.16 20.33,51.44 v23.39,51.44 | J2.2 48.11,51.02 v47.83,51.31 46.86,51.31 J2.3 46.61,51.31 v45.67,51.31 45.37,51 J2.1 | T2.2 24.15,57.08 23.39,56.32 v23.39,51.44 | QUECTEL_L76-M33.1 25.11,51.44 v23.39,51.44
  Top 0.813: C24.2 14.55,11.97 11.71,14.81 C25.2 11.71,18.06 12.34,18.69 LORA_PWR1.C LORA_ACT1.C | C11.1 20.73,37.57 20.3,37.14 C10.2 | C23.2 11.23,40.51 11.24,40.52 C22.1 11.24,40.44 14.54,37.14 C10.2 | MD2.24 v30,3 30.01,2.98 | MD2.1 19.04,31.07 17.58,32.52 C10.2
  Route15 0.508: v37.32,7.48 37.31,7.26 37.3,7.26
  pour Route15: -3,63 63,63 63,-3 -3,-3
GPS2_RESET
  Top 0.813: QUECTEL_L76-M33.9 22.42,42.6 R4.2
GPS_I2C_ENABLE  (via drill 0.35)
  Top 0.508: v41.79,38.06 U4.3 | T2.3 v27.07,58.16
  Route2 0.508: v27.07,58.16 32.74,52.49 v36.18,52.49
  Route15 0.508: v36.18,52.49 36.18,43.67 v41.79,38.06
  Bottom 0.508: J1.5 57.94,28.73 58.42,29.21 58.42,36.79 57.15,38.06 v41.79,38.06
  Bottom 0.61: J4.10 8.07,35.61 11.09,35.61 27.07,51.59 v27.07,58.16
GPS_RX  (via drill 0.35)
  Top 0.61: QUECTEL_L76-M33.2 v23.39,50.3
  Bottom 0.61: v23.39,50.3 11.27,38.18 5.32,38.18 3.73,36.59 J4.11
GPS_TX  (via drill 0.35)
  Top 0.61: QUECTEL_L76-M33.3 v23.39,49.2
  Bottom 0.61: v23.39,49.2 10.54,36.35 J4.12
L76_PPS
  Top 0.508: QUECTEL_L76-M33.4 30.21,48.1 31.56,49.45 31.56,53.5 33.02,54.96 T1.3
LORA_GPIO1
  Top 0.508: J1.8 53.38,25.84 42.45,25.84 41.68,25.07 41.68,18.53 40.24,17.09 MD2.36
LORA_GPIO2
  Top 0.508: J1.6 50.38,28.73 48.38,26.73 41.97,26.73 40.83,25.59 40.83,19.23 39.97,18.37 MD2.37
N$1
  Top 0.508: QGPS_LOCK.C 30.79,57.74 31.01,57.96 33.94,57.96 34.2,57.7 T1.1
N$2
  Top 0.3: U1.4 44.75,37.8 R2.2
N$8
  Top 0.508: T2.1 26.11,54.28 26.32,54.07 29.01,54.07 29.28,54.34 QGPS_STDBY.C
N$10
  Top 0.508: R6.2 44.48,43.72 L2.1
N$20
  Top 0.35: QGPS_STDBY.A 31.33,55.12 32.2,55.99 36.21,55.99 37.04,55.16 37.04,54.31 37.24,54.11 R34.1
N$24
  Top 0.508: QUECTEL_L76-M33.14 35.88,47 37.46,45.42 R6.1
N$37
  Top 0.35: R7.2 37.04,56.3 36.49,56.85 36.49,57.96 35.74,58.71 30.02,58.71 29.29,57.98 QGPS_LOCK.A
N$41
  Top 0.508: R23.1 21.09,20.89 MD2.9
N$42
  Top 0.508: LORA_ACT1.A 16.24,20.85 R23.2
N$43
  Top 0.508: LORA_PWR1.A 16.23,18.69 R21.2
RX_RN2483  (via drill 0.35)
  Top 0.813: MD2.6 v18.71,24.71
  Bottom 0.4: v18.71,24.71 12.48,24.71 9.72,27.47 4.99,27.47 J4.5
  Bottom 0.508: v18.71,24.71 37.8,24.71 39.53,26.44 46.36,26.44 J1.2
SCL1
  Top 0.3: U1.13 49.23,33.02 49.73,32.52 55.02,32.52 J1.3
  Route2 0.508: J4.8 41.25,31.27 45.93,35.95 57.45,35.95 58.1,35.3 58.1,33.1 J1.3
SCL2  (via drill 0.35)
  Top 0.305: IC3.8 40.2,52.14 39.98,52.36 39.08,52.36 38.68,51.96 v38.68,51.55
  Top 0.406: IC6.3 5.43,44.01 5.17,44.27 5.17,45.2 5.76,45.79 v6.26,45.79
  Route2 0.406: v6.26,45.79 7.63,47.16 35.18,47.16 38.68,50.66 v38.68,51.55
  Route2 0.508: v6.26,45.79 6.26,41.59 1.9,37.24 1.9,24.63 2.88,23.65 J4.1
SCL_L76
  Top 0.305: IC3.5 41.7,52.81 41.44,53.07 38.59,53.07 35.82,50.3 QUECTEL_L76-M33.17
SDA1
  Top 0.3: U1.12 55.44,36.3 56.27,35.47 J1.1
  Bottom 0.508: J1.1 56.27,35.45 55.45,36.27 50,36.27 46.66,32.93 13.23,32.93 9.03,28.73 J4.6
SDA2  (via drill 0.35)
  Top 0.305: IC3.1 40.2,47.65 39.88,47.33 39.09,47.33 38.66,47.76 v38.66,48.38
  Top 0.406: IC6.2 9.06,44.01 9.3,44.25 9.3,45.23 8.75,45.78 v8.23,45.78
  Route2 0.406: v8.23,45.78 36.06,45.78 v38.66,48.38
  Route15 0.508: v8.23,45.78 8.23,25.61 J4.2
SDA_L76
  Top 0.305: IC3.4 41.7,46.85 41.46,46.61 38.28,46.61 35.69,49.2 QUECTEL_L76-M33.16
TOP_LED  (via drill 0.35)
  Top 0.406: ESP32_LED.4 43.6,13.42 43.62,13.4 51.94,13.4 56.27,17.73 J1.7
  Top 0.61: v43.57,12.35 43.57,14.78 ESP32_LED.4
  Route2 0.61: J4.4 29.73,26.19 v43.57,12.35
TX_RN2483  (via drill 0.35)
  Top 0.813: MD2.7 v18.71,23.45
  Bottom 0.4: v18.71,23.45 8.75,23.45 7.28,24.91 5.01,24.91 J4.3
  Bottom 0.508: v18.71,23.45 38.67,23.45 40.49,25.26 46.93,25.26 52.94,31.27 J1.4
V_COIN
  Top 0.61: C16.1 C12.1 C14.1 20.07,45.9 QUECTEL_L76-M33.6
VDD  (via drill 0.35)
  Top 0.3: U1.3 45.95,37.3 v45.76,37.11 | v47.04,41.54 R1.2
  Top 0.508: R1.2 C2.2
  Route2 0.3: v45.76,37.11 45.76,41.1 46.2,41.54 v47.04,41.54